# EAGLE design LED STRIP (EAGLE 6.0)
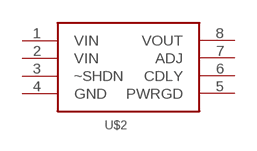
[diagram p0: schematic, sheet 1, part 1 of 2]
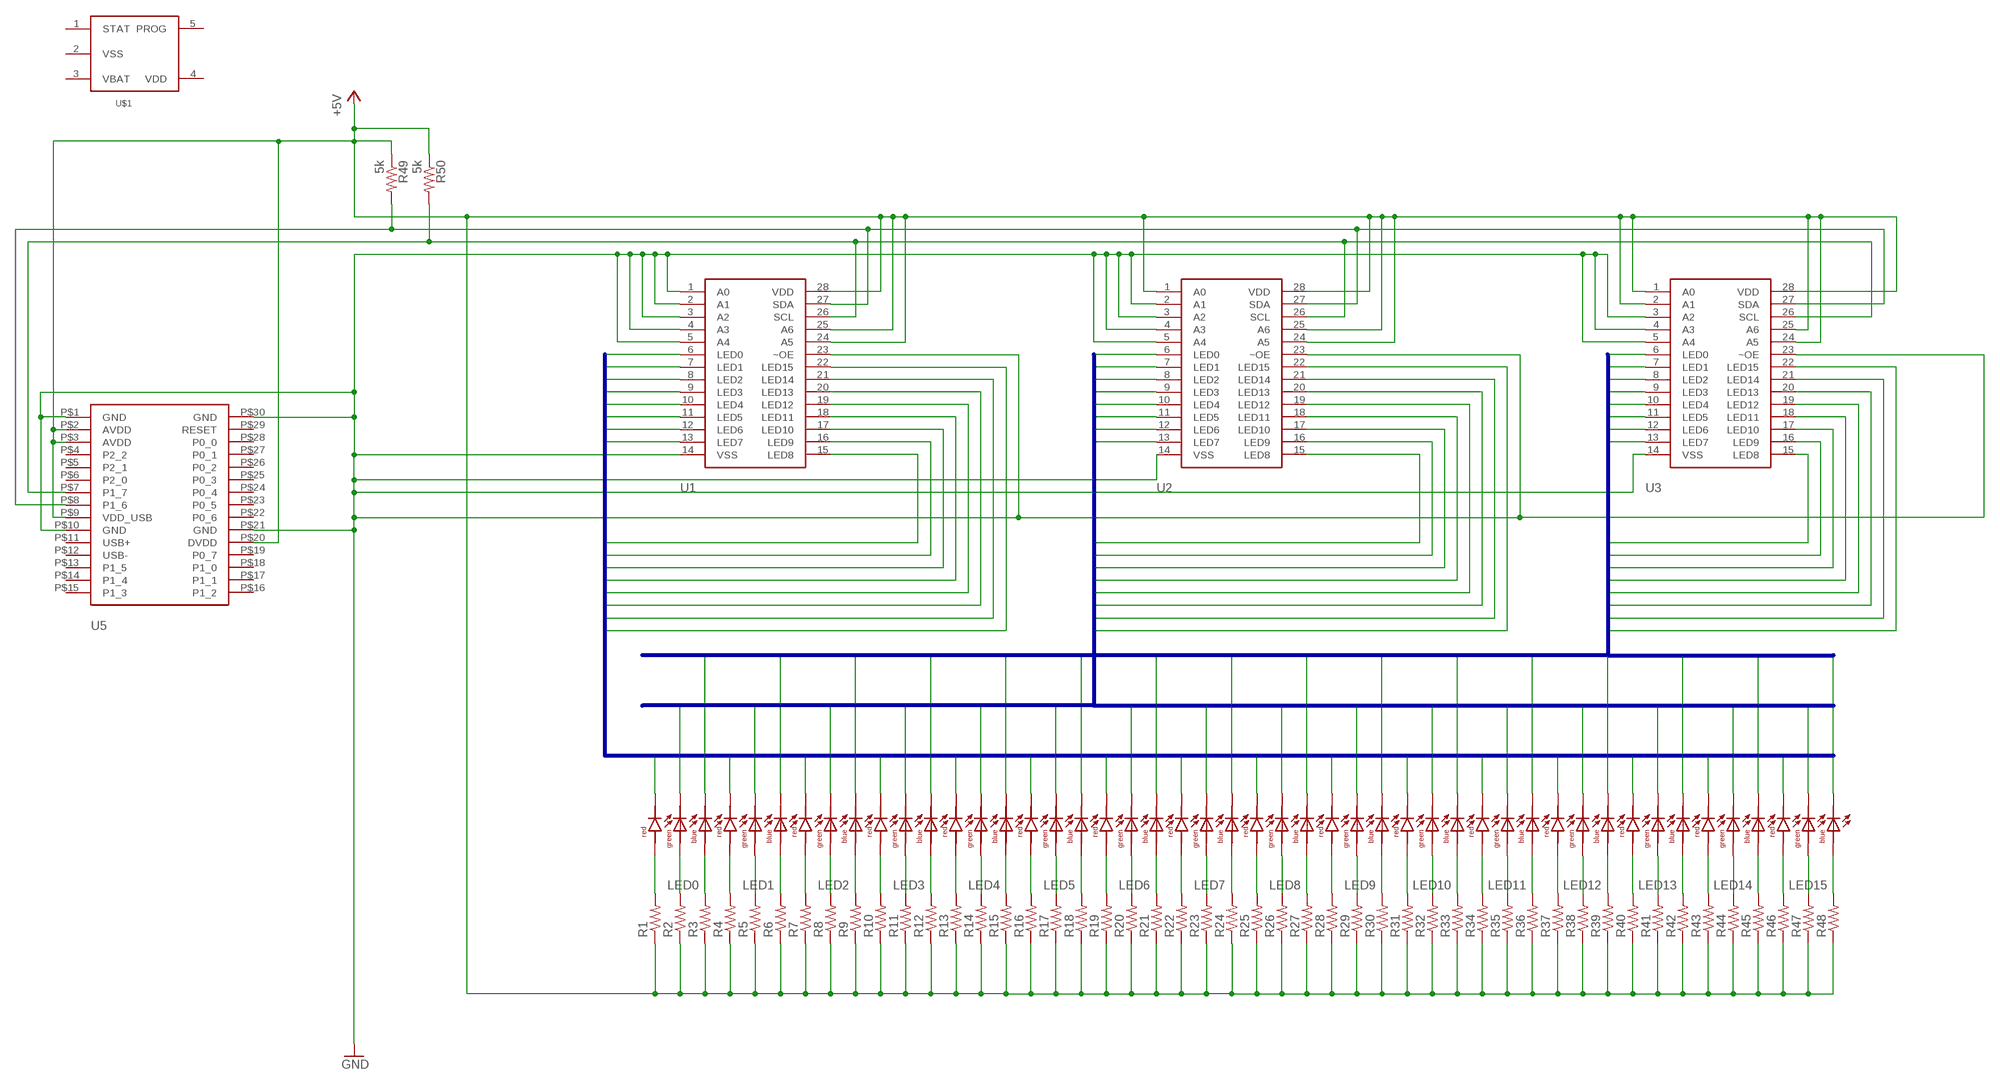
[diagram p1: schematic, sheet 1, part 2 of 2]

## Parts
LED0  LED_RGB  [6-PLCC]
LED1  LED_RGB  [6-PLCC]
LED2  LED_RGB  [6-PLCC]
LED3  LED_RGB  [6-PLCC]
LED4  LED_RGB  [6-PLCC]
LED5  LED_RGB  [6-PLCC]
LED6  LED_RGB  [6-PLCC]
LED7  LED_RGB  [6-PLCC]
LED8  LED_RGB  [6-PLCC]
LED9  LED_RGB  [6-PLCC]
LED10  LED_RGB  [6-PLCC]
LED11  LED_RGB  [6-PLCC]
LED12  LED_RGB  [6-PLCC]
LED13  LED_RGB  [6-PLCC]
LED14  LED_RGB  [6-PLCC]
LED15  LED_RGB  [6-PLCC]
R1  R0402  [0402]
R2  R0402  [0402]
R3  R0402  [0402]
R4  R0402  [0402]
R5  R0402  [0402]
R6  R0402  [0402]
R7  R0402  [0402]
R8  R0402  [0402]
R9  R0402  [0402]
R10  R0402  [0402]
R11  R0402  [0402]
R12  R0402  [0402]
R13  R0402  [0402]
R14  R0402  [0402]
R15  R0402  [0402]
R16  R0402  [0402]
R17  R0402  [0402]
R18  R0402  [0402]
R19  R0402  [0402]
R20  R0402  [0402]
R21  R0402  [0402]
R22  R0402  [0402]
R23  R0402  [0402]
R24  R0402  [0402]
R25  R0402  [0402]
R26  R0402  [0402]
R27  R0402  [0402]
R28  R0402  [0402]
R29  R0402  [0402]
R30  R0402  [0402]
R31  R0402  [0402]
R32  R0402  [0402]
R33  R0402  [0402]
R34  R0402  [0402]
R35  R0402  [0402]
R36  R0402  [0402]
R37  R0402  [0402]
R38  R0402  [0402]
R39  R0402  [0402]
R40  R0402  [0402]
R41  R0402  [0402]
R42  R0402  [0402]
R43  R0402  [0402]
R44  R0402  [0402]
R45  R0402  [0402]
R46  R0402  [0402]
R47  R0402  [0402]
R48  R0402  [0402]
R49  5k  R0402  [0402]
R50  5k  R0402  [0402]
U1  PCA9635  [TSSOP28]
U2  PCA9635  [TSSOP28]
U3  PCA9635  [TSSOP28]
U5  BLE112  [BLE112]
U$1  MCP73831  [SOT-23]
U$2  MCP1727  [8-SOIC]

## Nets
+5V: R1.P$1 R2.P$1 R3.P$1 R4.P$1 R5.P$1 R6.P$1 R7.P$1 R8.P$1 R9.P$1 R10.P$1 R11.P$1 R12.P$1 R13.P$1 R14.P$1 R15.P$1 R16.P$1 R17.P$1 R18.P$1 R19.P$1 R20.P$1 R21.P$1 R22.P$1 R23.P$1 R24.P$1 R25.P$1 R26.P$1 R27.P$1 R28.P$1 R29.P$1 R30.P$1 R31.P$1 R32.P$1 R33.P$1 R34.P$1 R35.P$1 R36.P$1 R37.P$1 R38.P$1 R39.P$1 R40.P$1 R41.P$1 R42.P$1 R43.P$1 R44.P$1 R45.P$1 R46.P$1 R47.P$1 R48.P$1 R49.P$1 R50.P$1 U1.24(A5) U1.25(A6) U1.28(VDD) U2.1(A0) U2.24(A5) U2.25(A6) U2.28(VDD) U3.1(A0) U3.2(A1) U3.24(A5) U3.25(A6) U3.28(VDD) U5.P$2(AVDD) U5.P$3(AVDD) U5.P$9(VDD_USB) U5.P$20(DVDD)
BLUE0: LED0.1 U3.6(LED0)
BLUE1: LED1.1 U3.7(LED1)
BLUE2: LED2.1 U3.8(LED2)
BLUE3: LED3.1 U3.9(LED3)
BLUE4: LED4.1 U3.10(LED4)
BLUE5: LED5.1 U3.11(LED5)
BLUE6: LED6.1 U3.12(LED6)
BLUE7: LED7.1 U3.13(LED7)
BLUE8: LED8.1 U3.15(LED8)
BLUE9: LED9.1 U3.16(LED9)
BLUE10: LED10.1 U3.17(LED10)
BLUE11: LED11.1 U3.18(LED11)
BLUE12: LED12.1 U3.19(LED12)
BLUE13: LED13.1 U3.20(LED13)
BLUE14: LED14.1 U3.21(LED14)
BLUE15: LED15.1 U3.22(LED15)
GND: U1.1(A0) U1.2(A1) U1.3(A2) U1.4(A3) U1.5(A4) U1.14(VSS) U1.23(~OE) U2.2(A1) U2.3(A2) U2.4(A3) U2.5(A4) U2.14(VSS) U2.23(~OE) U3.3(A2) U3.4(A3) U3.5(A4) U3.14(VSS) U3.23(~OE) U5.P$1(GND) U5.P$10(GND) U5.P$21(GND) U5.P$30(GND)
GREEN0: LED0.2 U2.6(LED0)
GREEN1: LED1.2 U2.7(LED1)
GREEN2: LED2.2 U2.8(LED2)
GREEN3: LED3.2 U2.9(LED3)
GREEN4: LED4.2 U2.10(LED4)
GREEN5: LED5.2 U2.11(LED5)
GREEN6: LED6.2 U2.12(LED6)
GREEN7: LED7.2 U2.13(LED7)
GREEN8: LED8.2 U2.15(LED8)
GREEN9: LED9.2 U2.16(LED9)
GREEN10: LED10.2 U2.17(LED10)
GREEN11: LED11.2 U2.18(LED11)
GREEN12: LED12.2 U2.19(LED12)
GREEN13: LED13.2 U2.20(LED13)
GREEN14: LED14.2 U2.21(LED14)
GREEN15: LED15.2 U2.22(LED15)
N$3: LED15.6 R48.P$2
N$4: LED0.5 R2.P$2
N$5: LED15.4 R46.P$2
N$6: LED14.6 R45.P$2
N$7: LED1.5 R5.P$2
N$8: LED14.4 R43.P$2
N$9: LED13.6 R42.P$2
N$10: LED2.5 R8.P$2
N$11: LED13.4 R40.P$2
N$12: LED12.6 R39.P$2
N$13: LED3.5 R11.P$2
N$14: LED10.4 R31.P$2
N$15: LED9.6 R30.P$2
N$16: LED4.5 R14.P$2
N$17: LED9.4 R28.P$2
N$18: LED8.6 R27.P$2
N$19: LED5.5 R17.P$2
N$20: LED7.6 R24.P$2
N$21: LED8.4 R25.P$2
N$22: LED6.5 R20.P$2
N$23: LED7.4 R22.P$2
N$24: LED6.6 R21.P$2
N$25: LED7.5 R23.P$2
N$26: LED6.4 R19.P$2
N$27: LED5.4 R16.P$2
N$28: LED8.5 R26.P$2
N$29: LED4.6 R15.P$2
N$30: LED4.4 R13.P$2
N$31: LED9.5 R29.P$2
N$32: LED3.6 R12.P$2
N$33: LED3.4 R10.P$2
N$34: LED10.5 R32.P$2
N$35: LED2.6 R9.P$2
N$36: LED1.6 R6.P$2
N$37: LED11.5 R35.P$2
N$38: LED1.4 R4.P$2
N$39: LED0.6 R3.P$2
N$40: LED12.5 R38.P$2
N$41: LED0.4 R1.P$2
N$42: LED2.4 R7.P$2
N$43: LED13.5 R41.P$2
N$44: LED5.6 R18.P$2
N$45: LED10.6 R33.P$2
N$46: LED14.5 R44.P$2
N$47: LED11.4 R34.P$2
N$48: LED11.6 R36.P$2
N$49: LED15.5 R47.P$2
N$50: LED12.4 R37.P$2
RED0: LED0.3 U1.6(LED0)
RED1: LED1.3 U1.7(LED1)
RED2: LED2.3 U1.8(LED2)
RED3: LED3.3 U1.9(LED3)
RED4: LED4.3 U1.10(LED4)
RED5: LED5.3 U1.11(LED5)
RED6: LED6.3 U1.12(LED6)
RED7: LED7.3 U1.13(LED7)
RED8: LED8.3 U1.15(LED8)
RED9: LED9.3 U1.16(LED9)
RED10: LED10.3 U1.17(LED10)
RED11: LED11.3 U1.18(LED11)
RED12: LED12.3 U1.19(LED12)
RED13: LED13.3 U1.20(LED13)
RED14: LED14.3 U1.21(LED14)
RED15: LED15.3 U1.22(LED15)
SCL: R50.P$2 U1.26(SCL) U2.26(SCL) U3.26(SCL) U5.P$7(P1_7)
SDA: R49.P$2 U1.27(SDA) U2.27(SDA) U3.27(SDA) U5.P$8(P1_6)
Unconnected: U5.P$4(P2_2) U5.P$5(P2_1) U5.P$6(P2_0) U5.P$11(USB+) U5.P$12(USB-) U5.P$13(P1_5) U5.P$14(P1_4) U5.P$15(P1_3) U5.P$16(P1_2) U5.P$17(P1_1) U5.P$18(P1_0) U5.P$19(P0_7) U5.P$22(P0_6) U5.P$23(P0_5) U5.P$24(P0_4) U5.P$25(P0_3) U5.P$26(P0_2) U5.P$27(P0_1) U5.P$28(P0_0) U5.P$29(RESET) U$1.1(STAT) U$1.2(VSS) U$1.3(VBAT) U$1.4(VDD) U$1.5(PROG) U$2.1(VIN) U$2.2(VIN) U$2.3(~SHDN) U$2.4(GND) U$2.5(PWRGD) U$2.6(CDLY) U$2.7(ADJ) U$2.8(VOUT)

## Buses
RED[0..15]
GREEN[0..15]
BLUE[0..15]

## Library data of the parts
LED0 LED1-LED15 = lightsuits:LED_RGB
R1-R50 = lightsuits:R0402
U1-U3 = lightsuits:PCA9635: The PCA9635 is an I2C-bus controlled 16-bit LED driver optimized for Red/Green/Blue/Amber (RGBA) color mixing applications. Each LED output has its own 8-bit resolution (256 steps) ﬁxed frequency individual PWM controller that operates at 97 kHz with a duty cycle that is adjustable from 0 % to 99.6 % to allow the LED to be set to a speciﬁc brightness value. An additional 8-bit resolution (256 steps) group PWM controller has both a ﬁxed frequency of 190 Hz and an adjustable frequency between 24 Hz to once every 10.73 seconds with a duty cycle that is adjustable from 0 % to 99.6% that is used to either dim or blink all LEDs with the same value.
U5 = lightsuits:BLE112
U$1 = lightsuits:MCP73831
U$2 = lightsuits:MCP1727

## Board
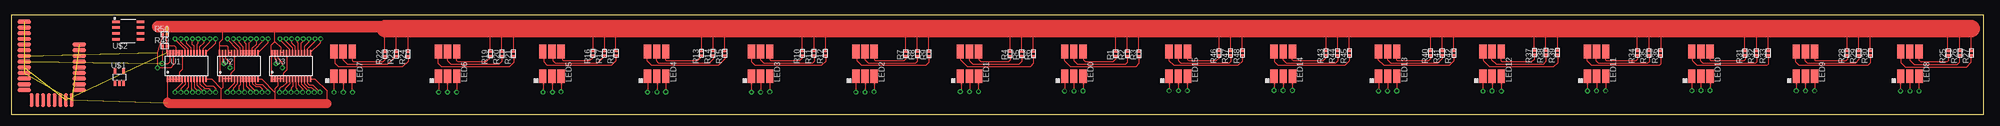
[diagram p2: board, top side]
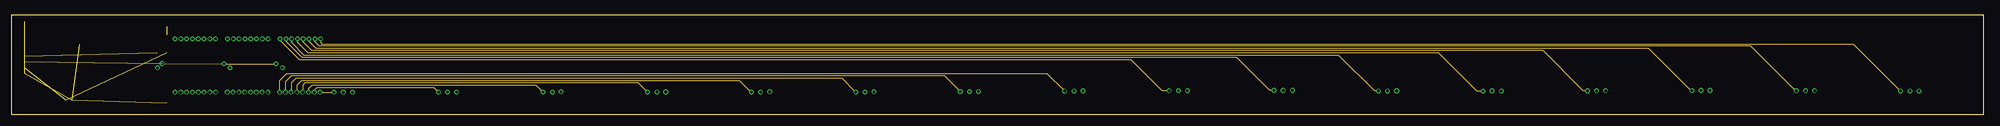
[diagram p3: board, inner layer Inner1]
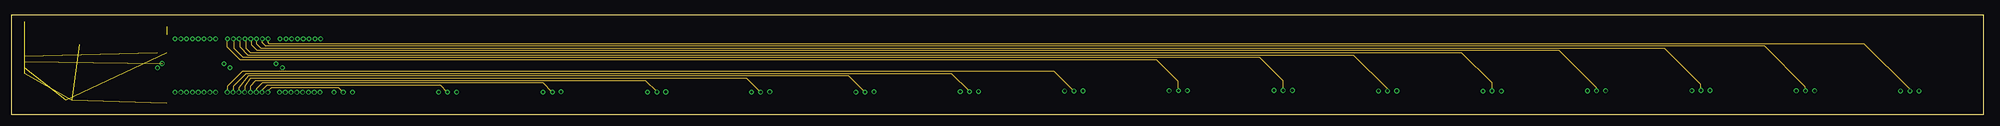
[diagram p4: board, inner layer Inner2]
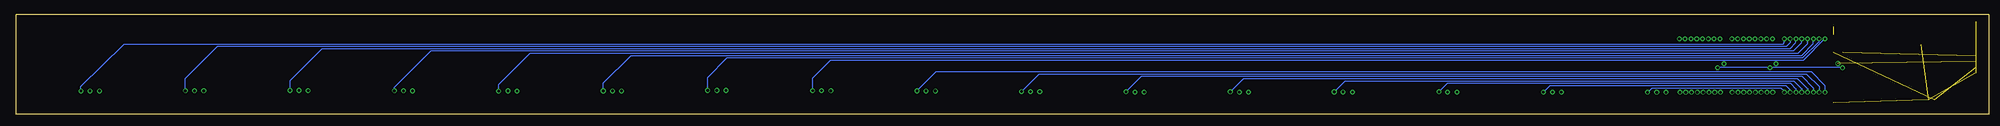
[diagram p5: board, bottom side, seen from below]

Size 431.8 x 21.84 mm. Coordinates in mm from the lower left corner, seen from the top.
Outline: 0,0 431.8,0 431.8,21.84 0,21.84 0,0
Copper layers (1*2+15*16): Top 0.035mm / dielectric 1.5mm / Inner1 0.035mm / dielectric 0.15mm / Inner2 0.035mm / dielectric 0.2mm / Bottom 0.035mm
Design rules: minimum track width 10mil, minimum drill 23mil, track to track 8mil, track to pad 8mil, pad to pad 8mil, via to via 8mil, smd to smd 8mil, copper to edge 40mil, drill to drill 8mil, minimum pad ring 10mil, minimum via ring 8mil, stop-mask expansion 4mil, vias tented up to drill 0mil, thermal gap 10mil

### Footprints (pad centres in the part's own frame; a part is rotated, then mirrored left to right if it is on the bottom)
6-PLCC = smd 3 x 1.6: 1 0,0; 2 0,-2; 3 0,-4; 4 5.4,-4; 5 5.4,-2; 6 5.4,0
0402 = smd 0.4 x 0.6: P$1 0,0; P$2 0.9,0
TSSOP28 = smd 0.35 x 1.2: 1 -4.225,-2.9; 2 -3.575,-2.9; 3 -2.925,-2.9; 4 -2.275,-2.9; 5 -1.625,-2.9; 6 -0.975,-2.9; 7 -0.325,-2.9; 8 0.325,-2.9; 9 0.975,-2.9; 10 1.625,-2.9; 11 2.275,-2.9; 12 2.925,-2.9; 13 3.575,-2.9; 14 4.225,-2.9; 15 4.225,2.9; 16 3.575,2.9; 17 2.925,2.9; 18 2.275,2.9; 19 1.625,2.9; 20 0.975,2.9; 21 0.325,2.9; 22 -0.325,2.9; 23 -0.975,2.9; 24 -1.625,2.9; 25 -2.275,2.9; 26 -2.925,2.9; 27 -3.575,2.9; 28 -4.225,2.9
BLE112 = smd 3 x 0.85: P$1 0,0; P$2 0,-1.25; P$3 0,-2.5; P$4 0,-3.75; P$5 0,-5; P$6 0,-6.25; P$7 0,-7.5; P$8 0,-8.75; P$9 0,-10; P$10 0,-11.25; P$11 0,-12.5; P$12 0,-13.75; P$13 0,-15; P$22 12.05,-15; P$23 12.05,-13.75; P$24 12.05,-12.5; P$25 12.05,-11.25; P$26 12.05,-10; P$27 12.05,-8.75; P$28 12.05,-7.5; P$29 12.05,-6.25; P$30 12.05,-5 | smd 0.85 x 3: P$14 1.65,-17.2; P$15 2.9,-17.2; P$16 4.15,-17.2; P$17 5.4,-17.2; P$18 6.65,-17.2; P$19 7.9,-17.2; P$20 9.15,-17.2; P$21 10.4,-17.2
SOT-23 = smd 0.55 x 1.2: 1 -0.95,-1.3; 2 0,-1.3; 3 0.95,-1.3; 4 0.95,1.3; 5 -0.95,1.3
8-SOIC = smd 1.6 x 0.55: 1 0,0; 2 0,-1.27; 3 0,-2.54; 4 0,-3.81; 5 5.4,-3.81; 6 5.4,-2.54; 7 5.4,-1.27; 8 5.4,0

### Placement (x,y rotation side)
LED0  230.57,8.38 90 top
LED1  207.71,8.38 90 top
LED2  184.85,8.38 90 top
LED3  161.99,8.38 90 top
LED4  139.25,8.38 90 top
LED5  116.33,8.38 90 top
LED6  93.47,8.38 90 top
LED7  70.61,8.38 90 top
LED8  413.57,8.38 90 top
LED9  390.71,8.38 90 top
LED10  367.85,8.38 90 top
LED11  344.99,8.38 90 top
LED12  322.13,8.38 90 top
LED13  299.27,8.38 90 top
LED14  276.41,8.38 90 top
LED15  253.43,8.38 90 top
R1  241.75,13.72 270 top
R2  244.29,13.72 270 top
R3  246.83,13.72 270 top
R4  218.63,13.72 270 top
R5  221.17,13.72 270 top
R6  223.71,13.72 270 top
R7  195.77,13.72 270 top
R8  198.31,13.72 270 top
R9  200.85,13.72 270 top
R10  173.17,13.84 270 top
R11  175.71,13.84 270 top
R12  178.25,13.84 270 top
R13  151.07,13.84 270 top
R14  153.61,13.84 270 top
R15  156.15,13.84 270 top
R16  127.32,13.84 270 top
R17  129.86,13.84 270 top
R18  132.4,13.84 270 top
R19  104.84,13.72 270 top
R20  107.38,13.72 270 top
R21  109.92,13.72 270 top
R22  81.75,13.69 270 top
R23  84.29,13.69 270 top
R24  86.83,13.69 270 top
R25  423.99,13.92 270 top
R26  426.53,13.92 270 top
R27  429.07,13.92 270 top
R28  401.86,13.92 270 top
R29  404.4,13.92 270 top
R30  406.94,13.92 270 top
R31  379.51,13.92 270 top
R32  382.05,13.92 270 top
R33  384.59,13.92 270 top
R34  355.94,13.92 270 top
R35  358.48,13.92 270 top
R36  361.02,13.92 270 top
R37  333.38,14 270 top
R38  335.92,14 270 top
R39  338.46,14 270 top
R40  310.68,13.89 270 top
R41  313.22,13.89 270 top
R42  315.76,13.89 270 top
R43  287.79,13.92 270 top
R44  290.33,13.92 270 top
R45  292.87,13.92 270 top
R46  264.37,13.89 270 top
R47  266.91,13.89 270 top
R48  269.45,13.89 270 top
R49  34.04,14.99 180 top
R50  34.04,17.53 180 top
U1  38.35,10.62 0 top
U2  49.78,10.62 0 top
U3  61.21,10.62 0 top
U5  2.79,20.32 0 top
U$1  23.62,8.13 0 top
U$2  22.86,20.32 0 top

### Tracks (layer width: path | path; a pad name or v marks a point on that pad's centre or on a via)
+5V  (5 unrouted)
  Top 0.254: R22.P$1 81.75,18.75 81.79,18.8 | R23.P$1 84.29,18.75 84.33,18.8 | R24.P$1 86.83,18.5 87.12,18.8 | R19.P$1 104.84,18.74 104.9,18.8 | R20.P$1 107.38,18.6 107.19,18.8 | R21.P$1 109.92,18.6 109.73,18.8 | R16.P$1 127.32,18.73 127.25,18.8 | R17.P$1 129.86,18.73 129.79,18.8 | R18.P$1 132.4,13.9 132.33,13.97 132.33,18.54 132.59,18.8 | R13.P$1 151.07,19.87 150.88,20.07 150.88,19.3 151.38,18.8 | R14.P$1 153.61,18.6 153.42,18.8 | R15.P$1 156.15,18.74 156.21,18.8 | R10.P$1 173.17,18.74 173.23,18.8 | R11.P$1 175.71,18.48 176.02,18.8 | R12.P$1 178.25,18.6 178.05,18.8 | R7.P$1 195.77,18.35 195.33,18.8 | R8.P$1 198.31,18.6 198.12,18.8 | R9.P$1 200.85,18.6 200.66,18.8 | R4.P$1 218.63,18.6 218.44,18.8 | R5.P$1 221.17,18.74 221.23,18.8 | R6.P$1 223.71,18.6 223.52,18.8 | R1.P$1 241.75,18.74 241.81,18.8 | R2.P$1 244.29,18.6 244.09,18.8 | R3.P$1 246.83,18.74 246.89,18.8 | R46.P$1 264.37,18.75 264.41,18.8 | R47.P$1 266.91,18.58 266.7,18.8 | R48.P$1 269.45,18.5 269.75,18.8 | R43.P$1 287.79,19.3 287.53,19.56 287.53,19.3 288.04,18.8 | R44.P$1 290.33,18.55 290.58,18.8 | R45.P$1 292.87,18.79 292.86,18.8 | R40.P$1 310.68,18.25 310.13,18.8 | R41.P$1 313.22,18 312.42,18.8 | R42.P$1 315.76,18.51 315.47,18.8 | R37.P$1 333.38,18.41 332.99,18.8 | R38.P$1 335.92,18.66 335.79,18.8 | R39.P$1 338.46,18.41 338.07,18.8 | R34.P$1 355.94,18.46 355.6,18.8 | R35.P$1 358.48,18.46 358.14,18.8 | R36.P$1 361.14,13.92 361.19,13.97 361.19,18.29 360.68,18.8 | R31.P$1 379.48,13.97 379.48,18.54 379.73,18.8 | R32.P$1 382.05,18.51 381.76,18.8 | R33.P$1 384.56,13.97 384.56,18.8 | R28.P$1 401.83,13.97 401.83,18.54 401.57,18.8 | R29.P$1 404.4,18.25 403.86,18.8 | R30.P$1 406.91,13.97 406.91,18.8
  Top 0.254: R25.P$1 423.98,13.92 423.93,13.97 423.93,18.54 423.67,18.8 | R26.P$1 426.53,18.48 426.21,18.8 | R27.P$1 429.06,13.92 429.01,13.97 429.01,18.54 428.75,18.8 | 57.78,15.88 57.66,16 57.66,19.3 | 57.78,15.88 58.93,14.73 58.93,13.53 U3.25 U3.24 | 45.56,14.99 U2.28 U2.1 | 45.56,14.99 45.56,15.84 46.23,16.51 46.23,19.05 46.48,19.3 | U3.2 U3.1 U3.28 56.9,13.61 56.9,15.24 57.53,15.88 57.78,15.88 | U1.24 U1.25 36.07,13.52 36.07,14.66 35.74,14.99 R49.P$1 | U2.24 U2.25 47.5,13.53 47.5,14.73 47.24,14.99 45.56,14.99 | 32,20.24 32,19.3 | U1.28 34.04,13.52 R49.P$1 | R49.P$1 34.04,19.3
  Top 2.54: 32,19.3 34.04,19.3 46.48,19.3 57.66,19.3 81.79,19.3 | 81.79,19.3 82.55,18.54 | 81.79,19.3 81.79,18.8
  Top 3.81: 81.79,18.8 84.33,18.8 87.12,18.8 104.9,18.8 107.19,18.8 109.73,18.8 127.25,18.8 129.79,18.8 132.59,18.8 151.38,18.8 153.42,18.8 156.21,18.8 173.23,18.8 176.02,18.8 178.05,18.8 195.33,18.8 198.12,18.8 200.66,18.8 218.44,18.8 221.23,18.8 223.52,18.8 241.81,18.8 244.09,18.8 246.89,18.8 264.41,18.8 266.7,18.8 269.75,18.8 288.04,18.8 290.58,18.8 292.86,18.8 310.13,18.8 312.42,18.8 315.47,18.8 332.99,18.8 335.79,18.8 338.07,18.8 355.6,18.8 358.14,18.8 360.68,18.8 379.73,18.8 381.76,18.8 384.56,18.8 401.57,18.8 403.86,18.8 406.91,18.8 423.67,18.8 426.21,18.8 428.75,18.8 429.01,18.8
BLUE0  (via drill 0.6)
  Top 0.254: U3.6 60.24,6.9 59.31,5.97 59.05,5.97 58.67,5.59 v58.67,4.83 | LED0.1 v230.56,5.11
  Inner1 0.254: v230.56,5.11 226.78,8.89 60.2,8.89 58.67,7.37 v58.67,4.83
BLUE1  (via drill 0.6)
  Top 0.254: U3.7 60.89,6.66 59.94,5.71 v59.94,4.83 | LED1.1 207.97,8.11 207.97,5.25 v207.71,4.98
  Inner1 0.254: v59.94,4.83 59.94,7.11 61.21,8.38 204.29,8.38 207.7,4.98 v207.71,4.98
BLUE2  (via drill 0.6)
  Top 0.254: U3.8 61.54,6.17 61.21,5.84 v61.21,4.83 | LED2.1 v184.84,4.85
  Inner1 0.254: v61.21,4.83 61.21,6.86 62.23,7.87 181.82,7.87 v184.84,4.85
BLUE3  (via drill 0.6)
  Top 0.254: U3.9 62.19,5.88 62.48,5.59 v62.48,4.83 | LED3.1 v161.99,4.85
  Inner1 0.254: v161.99,4.85 159.47,7.37 63.5,7.37 62.48,6.35 v62.48,4.83
BLUE4  (via drill 0.6)
  Top 0.254: U3.10 62.84,6.5 63.75,5.59 v63.75,4.83 | LED4.1 v139.25,4.85
  Inner1 0.254: v139.25,4.85 137.25,6.86 64.26,6.86 63.75,6.35 v63.75,4.83
BLUE5  (via drill 0.6)
  Top 0.254: U3.11 63.49,6.67 65.02,5.13 v65.02,4.83 | LED5.1 116.39,8.32 v116.39,4.85
  Inner1 0.254: v116.39,4.85 114.89,6.35 65.79,6.35 65.02,5.59 v65.02,4.83
BLUE6  (via drill 0.6)
  Top 0.254: U3.12 64.14,6.75 65.02,5.87 65.66,5.87 66.29,5.33 v66.29,4.83 | LED6.1 93.53,8.32 v93.53,4.85
  Inner1 0.254: v93.53,4.85 92.54,5.84 66.8,5.84 66.29,5.33 v66.29,4.83
BLUE7  (via drill 0.6)
  Top 0.254: U3.13 64.77,6.86 65.15,6.48 65.91,6.48 v67.56,4.83 | LED7.1 v70.61,4.83
  Inner1 0.254: v67.56,4.83 v70.61,4.83
BLUE8  (via drill 0.6)
  Top 0.254: U3.15 67.7,15.79 v67.7,16.58 | 413.53,8.34 LED8.1 413.57,5.15 v413.53,5.11
  Inner1 0.254: v67.7,16.58 v67.69,16.56 67.69,15.72 67.94,15.47 403.15,15.47 413.51,5.11 v413.53,5.11
BLUE9  (via drill 0.6)
  Top 0.254: U3.16 64.8,14.33 66.43,15.96 v66.43,16.58 | LED9.1 v390.71,5.16 v390.72,5.16
  Inner1 0.254: v390.72,5.16 390.58,5.16 380.75,14.99 67.41,14.99 66.43,15.96 v66.43,16.58
BLUE10  (via drill 0.6)
  Top 0.254: U3.17 64.16,13.54 64.16,14.99 65.16,15.99 v65.16,16.58 | LED10.1 v367.85,5.21 v367.86,5.21
  Inner1 0.254: v367.86,5.21 367.67,5.21 358.39,14.48 66.68,14.48 65.16,15.99 v65.16,16.58
BLUE11  (via drill 0.6)
  Top 0.254: U3.18 63.48,13.54 63.48,15.65 63.89,16.07 v63.89,16.58 | LED11.1 v344.99,5.14 v345,5.13
  Inner1 0.254: v345,5.13 344.12,5.13 335.28,13.97 65.79,13.97 63.79,15.96 63.79,16.47 v63.89,16.58
BLUE12  (via drill 0.6)
  Top 0.254: U3.19 62.81,13.55 62.81,15.62 62.62,15.81 v62.62,16.58 | LED12.1 322.13,5.07 v322.11,5.05
  Inner1 0.254: v322.11,5.05 320.83,5.05 312.42,13.46 64.97,13.46 62.7,15.74 62.7,16.5 v62.62,16.58
BLUE13  (via drill 0.6)
  Top 0.254: U3.20 62.18,14.86 61.35,15.68 v61.35,16.58 | LED13.1 299.27,5.12 v299.25,5.11
  Inner1 0.254: v299.25,5.11 298.43,5.11 290.58,12.95 64.15,12.95 61.35,15.75 v61.35,16.58
BLUE14  (via drill 0.6)
  Top 0.254: U3.21 61.54,14.58 60.08,16.04 v60.08,16.58 | LED14.1 276.41,5.25 v276.39,5.23
  Inner1 0.254: v276.39,5.23 275.44,5.23 268.22,12.45 63.68,12.45 60.08,16.04 v60.08,16.58
BLUE15  (via drill 0.6)
  Top 0.254: U3.22 60.88,14.2 58.81,16.27 v58.81,16.58 | LED15.1 v253.43,5.16
  Inner1 0.254: v253.43,5.16 251.89,5.16 245.11,11.94 63.14,11.94 59,16.08 59,16.39 v58.81,16.58
GND  (4 unrouted)
  Top 0.254: 45.97,5.59 46.21,5.82 U2.2 U2.3 U2.4 U2.5 48.16,9.04 48.81,9.69 U2.23 | 34.04,2.54 34.13,2.63 U1.1 U1.2 U1.3 U1.4 U1.5 36.73,9.17 37.38,9.82 U1.23 | U1.14 43.84,7.72 45.97,5.59 | U3.14 66.45,7.72 69.09,5.08 69.09,2.29 | U3.23 60.24,9.69 59.59,9.04 U3.5 U3.4 U3.3 58.29,6.22 57.66,5.59 57.66,4.83 | 45.97,2.29 45.97,5.59 | U2.14 54.76,7.72 57.66,4.83 | 57.66,4.83 57.66,2.29
  Top 1.93: 69.09,2.29 57.66,2.29 45.97,2.29 34.48,2.29 34.13,2.63
GREEN0  (via drill 0.6)
  Top 0.254: U2.6 48.79,7.71 48.79,6.81 47.24,5.26 v47.24,4.83 | LED0.2 232.6,8.36 v232.6,5.11
  Inner2 0.254: v232.6,5.11 228.3,9.4 50.55,9.4 47.24,6.1 v47.24,4.83
GREEN1  (via drill 0.6)
  Top 0.254: U2.7 49.45,6.66 48.51,5.71 v48.51,4.83 | LED1.2 209.74,8.36 v209.74,4.98
  Inner2 0.254: v209.74,4.98 205.82,8.89 51.31,8.89 48.51,6.1 v48.51,4.83
GREEN2  (via drill 0.6)
  Top 0.254: U2.8 50.11,6.48 49.78,6.15 v49.78,4.83 | LED2.2 186.88,8.36 v186.88,4.85
  Inner2 0.254: v186.88,4.85 183.35,8.38 51.82,8.38 49.78,5.84 v49.78,4.83
GREEN3  (via drill 0.6)
  Top 0.254: U2.9 50.77,7.71 50.77,5.59 51.05,5.31 v51.05,4.83 | LED3.2 164.02,8.36 v164.02,4.85
  Inner2 0.254: v164.02,4.85 160.99,7.87 52.32,7.87 51.05,6.1 v51.05,4.83
GREEN4  (via drill 0.6)
  Top 0.254: U2.10 51.41,6.22 52.32,5.31 v52.32,4.83 | LED4.2 141.33,8.31 v141.33,4.89
  Inner2 0.254: v141.33,4.89 138.85,7.37 53.34,7.37 52.32,6.1 v52.32,4.83
GREEN5  (via drill 0.6)
  Top 0.254: U2.11 52.07,7.71 52.07,6.4 53.59,4.88 v53.59,4.83 | LED5.2 118.42,8.29 v118.42,4.85
  Inner2 0.254: v118.42,4.85 116.42,6.86 54.86,6.86 53.59,5.59 v53.59,4.83
GREEN6  (via drill 0.6)
  Top 0.254: U2.12 52.73,7.7 52.73,6.78 53.44,6.07 54.41,6.07 54.86,5.61 v54.86,4.83 | LED6.2 95.44,8.35 v95.44,4.85
  Inner2 0.254: v95.44,4.85 93.94,6.35 55.88,6.35 54.86,5.33 v54.86,4.83
GREEN7  (via drill 0.6)
  Top 0.254: LED7.2 72.61,4.86 v72.64,4.83 | U2.13 53.39,7.69 53.39,6.81 53.59,6.6 54.86,6.6 56.13,5.33 v56.13,4.83
  Inner2 0.254: v72.64,4.83 71.63,5.84 56.9,5.84 56.13,5.08 v56.13,4.83
GREEN8  (via drill 0.6)
  Top 0.254: U2.15 56.2,15.72 v56.2,16.58 | LED8.2 415.57,5.17 v415.64,5.11
  Inner2 0.254: v415.64,5.11 415.64,5.5 405.64,15.47 56.46,15.47 56.21,15.75 56.2,15.75 v56.2,16.58
GREEN9  (via drill 0.6)
  Top 0.254: U2.16 53.37,14.35 54.93,15.92 v54.93,16.58 | LED9.2 392.71,5.17 v392.73,5.16
  Inner2 0.254: v392.73,5.16 392.73,6.05 383.79,14.99 55.63,14.99 54.86,15.75 54.86,16.48 | 54.86,16.48 54.94,16.56 | v54.93,16.58 54.86,16.51 54.86,16.48
GREEN10  (via drill 0.6)
  Top 0.254: U2.17 52.7,14.5 53.66,15.46 v53.66,16.58 | LED10.2 369.85,5.24 v369.84,5.23
  Inner2 0.254: v369.84,5.23 369.84,6.59 361.95,14.48 54.65,14.48 53.66,15.46 v53.66,16.58
GREEN11  (via drill 0.6)
  Top 0.254: U2.18 52.07,15.7 52.39,16.02 v52.39,16.58 | LED11.2 346.99,5.17 v347.01,5.16
  Inner2 0.254: v347.01,5.16 347.01,5.8 338.84,13.97 53.85,13.97 52.58,15.24 52.58,16.39 v52.39,16.58
GREEN12  (via drill 0.6)
  Top 0.254: U2.19 51.41,15.42 51.12,15.7 v51.12,16.58 | LED12.2 324.13,5.14 v324.12,5.13
  Inner2 0.254: v324.12,5.13 324.12,6.84 317.5,13.46 52.43,13.46 51.41,14.48 51.41,16.29 v51.12,16.58
GREEN13  (via drill 0.6)
  Top 0.254: U2.20 50.77,13.54 50.77,14.81 49.85,15.73 v49.85,16.58 | LED13.2 301.27,5.12 v301.26,5.11
  Inner2 0.254: v301.26,5.11 301.26,5.57 293.88,12.95 51.82,12.95 50.04,14.73 50.04,16.39 v49.85,16.58
GREEN14  (via drill 0.6)
  Top 0.254: U2.21 50.11,14.5 48.58,16.03 v48.58,16.58 | LED14.2 278.41,5.24 v278.4,5.23
  Inner2 0.254: v278.4,5.23 278.4,7.35 273.3,12.45 50.8,12.45 48.77,14.48 48.77,16.39 v48.58,16.58
GREEN15  (via drill 0.6)
  Top 0.254: U2.22 49.45,14.25 47.31,16.39 v47.31,16.58 | LED15.2 255.43,5.21 v255.46,5.18
  Inner2 0.254: v255.46,5.18 255.46,7.17 250.7,11.94 50.04,11.94 47.24,14.73 47.24,16.51 v47.31,16.58
N$3
  Top 0.254: R48.P$2 269.45,11.64 268.48,10.67 254.51,10.67 253.49,11.68 253.49,13.72 LED15.6
N$4
  Top 0.254: R2.P$2 244.29,11.37 243.84,10.92 233.43,10.92 232.66,11.68 232.66,13.69 LED0.5
N$5
  Top 0.254: R46.P$2 264.37,12.4 263.65,11.68 257.81,11.68 257.56,11.94 257.56,13.66 LED15.4
N$6
  Top 0.254: R45.P$2 292.87,11.69 291.85,10.67 277.37,10.67 276.61,11.43 276.61,13.59 LED14.6
N$7
  Top 0.254: R5.P$2 221.17,11.62 220.47,10.92 210.57,10.92 209.8,11.68 209.8,13.69 LED1.5
N$8
  Top 0.254: R43.P$2 287.79,12.46 287.02,11.68 280.67,11.68 280.42,11.94 LED14.4
N$9
  Top 0.254: R42.P$2 315.76,11.72 314.71,10.67 300.48,10.67 299.21,11.94 299.21,13.72 LED13.6
N$10
  Top 0.254: R8.P$2 198.31,11.62 197.87,11.18 187.71,11.18 186.94,11.94 186.94,13.69 LED2.5
N$11
  Top 0.254: R40.P$2 310.68,12.23 310.13,11.68 303.53,11.68 303.28,11.94 LED13.4
N$12
  Top 0.254: R39.P$2 338.46,11.31 337.57,10.41 323.6,10.41 322.33,11.68 322.33,13.59 LED12.6
N$13
  Top 0.254: R11.P$2 175.71,11.62 175.26,11.18 164.85,11.18 164.08,11.94 164.08,13.69 LED3.5
N$14
  Top 0.254: R31.P$2 379.51,11.97 379.22,11.68 372.11,11.68 371.86,11.94 LED10.4
N$15
  Top 0.254: R30.P$2 406.94,11.21 406.4,10.67 391.41,10.67 390.65,11.43 390.65,13.72 LED9.6
N$16
  Top 0.254: R14.P$2 153.61,12.13 152.65,11.18 141.73,11.18 141.22,11.68 141.22,13.75 LED4.5
N$17
  Top 0.254: R28.P$2 401.86,11.97 401.57,11.68 394.97,11.68 394.71,11.94 LED9.4
N$18
  Top 0.254: LED8.6 413.57,11.37 414.53,10.41 427.99,10.41 429.01,11.43 429.01,12.96 R27.P$2
N$19
  Top 0.254: R17.P$2 129.86,12.77 128.27,11.18 119.13,11.18 118.62,11.68 118.62,13.5 LED5.5
N$20
  Top 0.254: 70.57,13.82 LED7.6 70.87,13.53 70.87,11.18 71.63,10.41 85.6,10.41 86.83,11.64 R24.P$2
N$21
  Top 0.254: R25.P$2 423.99,11.74 423.67,11.43 418.08,11.43 417.57,11.94 LED8.4
N$22
  Top 0.254: R20.P$2 107.38,11.62 106.68,10.92 96.27,10.92 95.5,11.68 95.5,13.75 LED6.5
N$23
  Top 0.254: 74.68,13.85 LED7.4 74.68,13.72 74.68,11.68 74.93,11.43 81.28,11.43 81.75,11.9 R22.P$2
N$24
  Top 0.254: R21.P$2 109.92,11.37 108.97,10.41 94.23,10.41 93.47,11.18 LED6.6
N$25
  Top 0.254: 72.64,13.81 LED7.5 72.64,13.75 72.64,11.94 73.66,10.92 82.3,10.92 84.16,12.79 R23.P$2
N$26
  Top 0.254: R19.P$2 104.84,12.39 103.89,11.43 97.79,11.43 97.54,11.68 97.54,13.72 LED6.4
N$27
  Top 0.254: R16.P$2 127.32,12.51 126.49,11.68 120.9,11.68 120.65,11.94 120.65,13.46 LED5.4
N$28
  Top 0.254: LED8.5 415.57,11.91 416.56,10.92 425.96,10.92 426.47,11.43 426.47,12.96 R26.P$2
N$29
  Top 0.254: R15.P$2 156.15,12.13 154.69,10.67 140.21,10.67 139.19,11.68 139.19,13.72 LED4.6
N$30
  Top 0.254: R13.P$2 151.07,12.64 150.11,11.68 143.51,11.68 143.26,11.94 LED4.4
N$31
  Top 0.254: R29.P$2 404.4,11.97 403.61,11.18 393.19,11.18 392.68,11.68 392.68,13.75 LED9.5
N$32
  Top 0.254: R12.P$2 178.25,11.62 177.29,10.67 162.81,10.67 162.05,11.43 162.05,13.72 LED3.6
N$33
  Top 0.254: R10.P$2 173.17,12.39 172.47,11.68 166.37,11.68 166.12,11.94 166.12,13.66 LED3.4
N$34
  Top 0.254: R32.P$2 382.05,11.46 381.76,11.18 370.33,11.18 369.82,11.68 369.82,13.75 LED10.5
N$35
  Top 0.254: R9.P$2 200.85,11.37 200.15,10.67 186.18,10.67 185.17,11.68 185.17,13.47 LED2.6
N$36
  Top 0.254: R6.P$2 223.71,11.12 223.01,10.41 209.3,10.41 207.77,11.94 207.77,13.72 LED1.6
N$37
  Top 0.254: R35.P$2 358.48,11.52 358.14,11.18 347.47,11.18 346.96,11.68 346.96,13.75 LED11.5
N$38
  Top 0.254: R4.P$2 218.63,11.88 218.19,11.43 212.34,11.43 211.84,11.94 211.84,13.66 LED1.4
N$39
  Top 0.254: R3.P$2 246.83,11.12 246.13,10.41 231.9,10.41 230.63,11.68 230.63,13.72 LED0.6
N$40
  Top 0.254: R38.P$2 335.92,11.57 335.28,10.92 325.12,10.92 324.1,11.94 324.1,13.75 LED12.5
N$41
  Top 0.254: R1.P$2 241.75,12.13 241.05,11.43 235.2,11.43 234.7,11.94 234.7,13.66 LED0.4
N$42
  Top 0.254: R7.P$2 195.77,12.13 195.33,11.68 189.23,11.68 188.98,11.94 188.98,13.66 LED2.4
N$43
  Top 0.254: R41.P$2 313.22,12.23 312.17,11.18 302.01,11.18 301.24,11.94 301.24,13.75 LED13.5
N$44
  Top 0.254: R18.P$2 132.34,12.94 132.33,12.95 132.33,11.68 131.32,10.67 117.35,10.67 116.59,11.43 116.59,13.53 LED5.6
N$45
  Top 0.254: R33.P$2 384.59,10.96 384.3,10.67 369.06,10.67 368.05,11.68 368.05,13.59 LED10.6
N$46
  Top 0.254: R44.P$2 290.33,11.69 289.81,11.18 279.15,11.18 278.38,11.94 278.38,13.75 LED14.5
N$47
  Top 0.254: R34.P$2 355.94,12.02 355.6,11.68 349.25,11.68 349,11.94 LED11.4
N$48
  Top 0.254: R36.P$2 361.02,11.01 360.68,10.67 345.95,10.67 344.93,11.68 344.93,13.72 LED11.6
N$49
  Top 0.254: R47.P$2 266.91,11.64 266.45,11.18 256.03,11.18 255.52,11.68 255.52,13.69 LED15.5
N$50
  Top 0.254: R37.P$2 333.38,12.07 332.74,11.43 326.39,11.43 326.14,11.68 LED12.4
RED0  (via drill 0.6)
  Top 0.254: U1.6 37.39,7.71 37.39,6.88 35.81,5.31 v35.81,4.83 | LED0.3 v234.58,5.13
  Bottom 0.254: v234.58,5.13 230.31,9.4 38.86,9.4 35.81,6.35 v35.81,4.83
RED1  (via drill 0.6)
  Top 0.254: U1.7 38.02,6.5 37.08,5.56 v37.08,4.83 | LED1.3 211.69,8.36 v211.69,5
  Bottom 0.254: v211.69,5 207.81,8.89 39.88,8.89 37.08,6.1 v37.08,4.83
RED2  (via drill 0.6)
  Top 0.254: U1.8 38.68,5.89 38.35,5.56 v38.35,4.83 | LED2.3 188.83,8.36 v188.83,4.93
  Bottom 0.254: v188.83,4.93 185.38,8.38 40.89,8.38 38.35,5.84 v38.35,4.83
RED3  (via drill 0.6)
  Top 0.254: U1.9 39.32,7.71 39.32,5.59 39.62,5.28 v39.62,4.83 | LED3.3 v166,4.93
  Bottom 0.254: v166,4.93 163.05,7.87 41.91,7.87 39.62,5.59 v39.62,4.83
RED4  (via drill 0.6)
  Top 0.254: U1.10 40.01,7.7 40.01,5.92 40.89,5.03 v40.89,4.83 | LED4.3 143.24,8.37 v143.24,4.9
  Bottom 0.254: v143.24,4.9 140.78,7.37 42.67,7.37 40.89,5.59 v40.89,4.83
RED5  (via drill 0.6)
  Top 0.254: v42.16,4.83 40.63,6.36 U1.11 | LED5.3 v120.33,4.93
  Bottom 0.254: v120.33,4.93 118.4,6.86 43.43,6.86 42.16,5.59 v42.16,4.83
RED6  (via drill 0.6)
  Top 0.254: U1.12 41.27,6.71 42.29,5.69 43.16,5.69 43.43,5.41 v43.43,4.83 | LED6.3 v97.47,4.85
  Bottom 0.254: v97.47,4.85 95.97,6.35 44.45,6.35 43.43,5.33 v43.43,4.83
RED7  (via drill 0.6)
  Top 0.254: v74.65,4.83 74.65,8.34 LED7.3 | U1.13 41.96,7.69 41.96,6.86 42.62,6.2 44.2,6.2 44.7,5.69 v44.7,4.83
  Bottom 0.254: v74.65,4.83 73.63,5.84 45.47,5.84 44.7,5.08 v44.7,4.83
RED8  (via drill 0.6)
  Top 0.254: U1.15 44.7,15.65 v44.7,16.58 | LED8.3 417.57,5.12 v417.59,5.11
  Bottom 0.254: v417.59,5.11 417.59,6.08 408.08,15.47 44.98,15.47 44.7,15.75 v44.7,16.58
RED9  (via drill 0.6)
  Top 0.254: U1.16 41.96,13.55 41.96,14.43 43.43,15.9 v43.43,16.58 | LED9.3 394.71,5.19 v394.74,5.16
  Bottom 0.254: v394.74,5.16 394.74,7.85 387.6,14.99 44.2,14.99 43.36,15.82 43.36,16.5 v43.43,16.58
RED10  (via drill 0.6)
  Top 0.254: U1.17 41.27,14.83 42.16,15.72 v42.16,16.58 | LED10.3 371.85,5.26 v371.82,5.23
  Bottom 0.254: v371.82,5.23 371.82,7.4 364.74,14.48 43.41,14.48 42.16,15.72 v42.16,16.58
RED11  (via drill 0.6)
  Top 0.254: U1.18 40.64,15.42 40.89,15.67 v40.89,16.58 | LED11.3 v348.99,5.16
  Bottom 0.254: v348.99,5.16 348.99,5.85 340.87,13.97 42.67,13.97 40.89,15.75 v40.89,16.58
RED12  (via drill 0.6)
  Top 0.254: U1.19 39.98,14.99 39.62,15.34 v39.62,16.58 | LED12.3 326.13,5.1 v326.15,5.08
  Bottom 0.254: v326.15,5.08 326.15,6.59 319.28,13.46 41.66,13.46 39.62,15.49 v39.62,16.58
RED13  (via drill 0.6)
  Top 0.254: U1.20 39.32,14.53 38.35,15.49 v38.35,16.58 | LED13.3 v303.27,5.14 v303.27,5.13
  Bottom 0.254: v303.27,5.13 303.27,6.87 297.18,12.95 40.89,12.95 38.35,15.49 v38.35,16.58
RED14  (via drill 0.6)
  Top 0.254: U1.21 38.66,13.54 38.66,14.33 37.08,15.9 v37.08,16.58 | LED14.3 v280.41,5.24 v280.41,5.23
  Bottom 0.254: v280.41,5.23 280.41,8.14 276.1,12.45 40.64,12.45 37.08,16 v37.08,16.58
RED15  (via drill 0.6)
  Top 0.254: U1.22 38.02,14.22 35.81,16.43 v35.81,16.58 | LED15.3 257.43,5.19 v257.42,5.18
  Bottom 0.254: v257.42,5.18 257.42,8.01 253.49,11.94 40.45,11.94 v35.81,16.58
SCL  (via drill 0.6)  (1 unrouted)
  Top 0.254: U2.26 46.86,12.34 47.75,11.46 47.75,11.43 47.78,11.41 v47.85,10.24 | U3.26 58.27,13.5 58.27,12.37 59.18,11.46 59.18,11.18 59.31,11.05 v59.31,10.24 | R50.P$2 31.95,13.53 v31.95,10.19 34.85,10.19 35.43,10.77 U1.26
  Bottom 0.254: v59.31,10.24 v47.85,10.24 32,10.24 v31.95,10.19
SDA  (via drill 0.6)  (1 unrouted)
  Top 0.254: U2.27 46.2,11.43 v46.53,11.07 | U3.27 57.66,13.5 57.66,12.19 57.94,11.91 v57.94,11.07 | R49.P$2 32.99,13.04 v32.99,11.15 34.37,11.15 34.78,11.56 U1.27
  Inner1 0.254: v57.94,11.07 v46.53,11.07 v32.99,11.15